# Altium schematic sheet 1_shkb_lite_top.SchDoc: =ProjectTitle
size A4; Address1: github.com/4pplet/SHKB; Address2: Licence: CERN-OHL-S; SheetNumber: 1; SheetTotal: 3
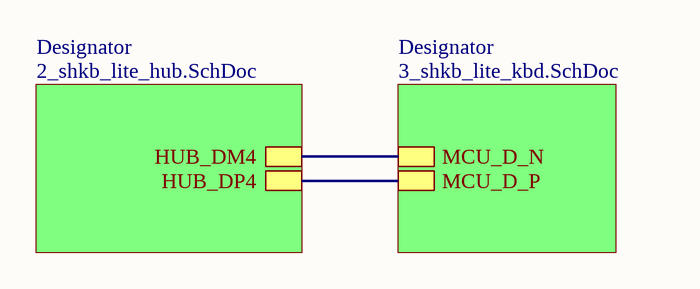
[diagram p0: 1_shkb_lite_top.SchDoc]

## Sub-sheets
Designator = 2_shkb_lite_hub.SchDoc: HUB_DM4, HUB_DP4
Designator = 3_shkb_lite_kbd.SchDoc: MCU_D_P, MCU_D_N

## Nets
(unnamed): sheet Designator/HUB_DM4, sheet Designator/MCU_D_N
(unnamed): sheet Designator/HUB_DP4, sheet Designator/MCU_D_P

## Notes on the sheet
- Title
- Size:
- Date:
- A4
- Number:
- Time:
- Revision:
- Sheet
- of
- File: